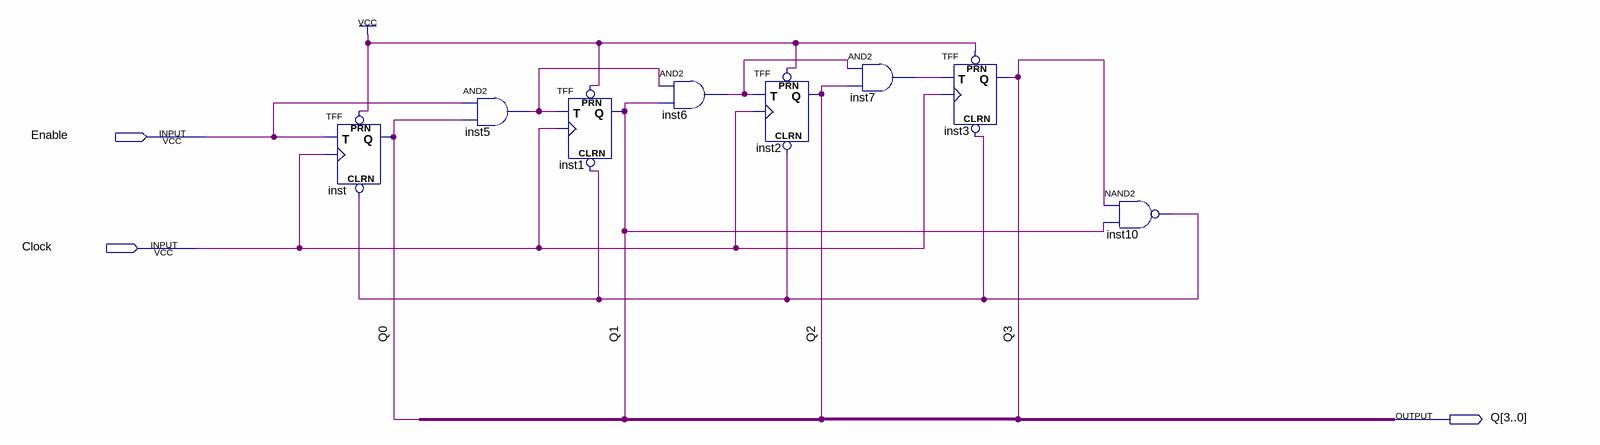
[diagram p0: schematic sheet]
// Quartus schematic upCounter.bdf as structural Verilog: 8 symbols, 3 pins
module upCounter (
  input  Enable,
  input  Clock,
  output [3:0] Q
);

  wire inst5_out, inst6_out, inst7_out, inst10_out;

  TFF inst (.PRN(1'b1), .CLRN(inst10_out), .T(Enable), .CLK(Clock), .Q(Q[0]));
  and inst5 (inst5_out, Enable, Q[0]);
  TFF inst1 (.PRN(1'b1), .CLRN(inst10_out), .T(inst5_out), .CLK(Clock), .Q(Q[1]));
  and inst6 (inst6_out, inst5_out, Q[1]);
  TFF inst2 (.PRN(1'b1), .CLRN(inst10_out), .T(inst6_out), .CLK(Clock), .Q(Q[2]));
  and inst7 (inst7_out, inst6_out, Q[2]);
  TFF inst3 (.PRN(1'b1), .CLRN(inst10_out), .T(inst7_out), .CLK(Clock), .Q(Q[3]));
  nand inst10 (inst10_out, Q[3], Q[1]);
endmodule
